# Altium project HFA.PrjPcb
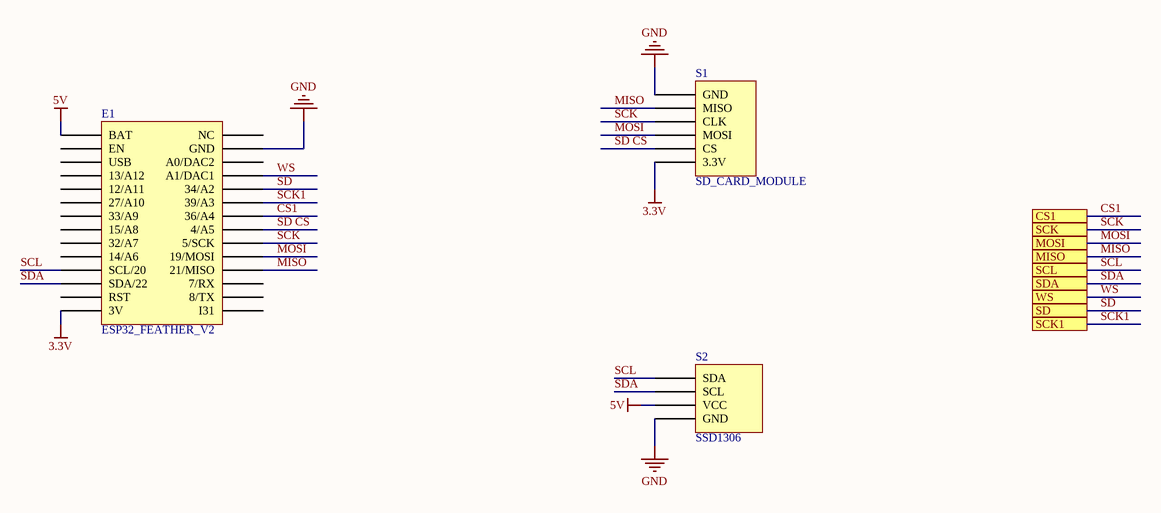
[diagram p0: SCREEN.SchDoc]
3 sheets, 10 parts. Net scope: flat (ports and power ports of the same name join across sheets).
Sheets:
  SCREEN.SchDoc
  SENSOR.SchDoc
  POWER.SchDoc

## Sheet SCREEN.SchDoc
size A4; SheetNumber: 1; SheetTotal: 3

### Parts
E1  ESP32_FEATHER_V2  [ESP32_FEATHER_V2]
S1  SD_CARD_MODULE  [MICRO_SD_CARD_MODULE]
S2  SSD1306  [SSD1306]

### Ports
CS1, MISO, MOSI, SCK, SCK1, SCL, SD, SDA, WS

### Nets
3.3V: E1.15(3V) S1.6(3.3V)
5V: E1.17(BAT) S2.3(VCC)
GND: E1.13(GND) S1.1(GND) S2.4(GND)
CS1: E1.8(36/A4) ; port CS1
MISO: E1.4(21/MISO) S1.2(MISO) ; port MISO
MOSI: E1.5(19/MOSI) S1.4(MOSI) ; port MOSI
SCK: E1.6(5/SCK) S1.3(CLK) ; port SCK
SCK1: E1.9(39/A3) ; port SCK1
SCL: E1.27(SCL/20) S2.1(SDA) ; port SCL
SD: E1.10(34/A2) ; port SD
SD CS: E1.7(4/A5) S1.5(CS)
SDA: E1.28(SDA/22) S2.2(SCL) ; port SDA
WS: E1.11(A1/DAC1) ; port WS

Not connected (* = marked no-connect by the designer): E1 1(I31) 2(8/TX) 3(7/RX) 12(A0/DAC2) 14(NC) 16(RST) 18(EN) 19(USB) 20(13/A12) 21(12/A11) 22(27/A10) 23(33/A9) 24(15/A8) 25(32/A7) 26(14/A6)

### Library data of the parts
E1 = ESP32_FEATHER_V2: ESP32 Feather V2
S2 = SSD1306: 0.96 inch, 128x64

## Sheet SENSOR.SchDoc
size A4; SheetNumber: 2; SheetTotal: 3
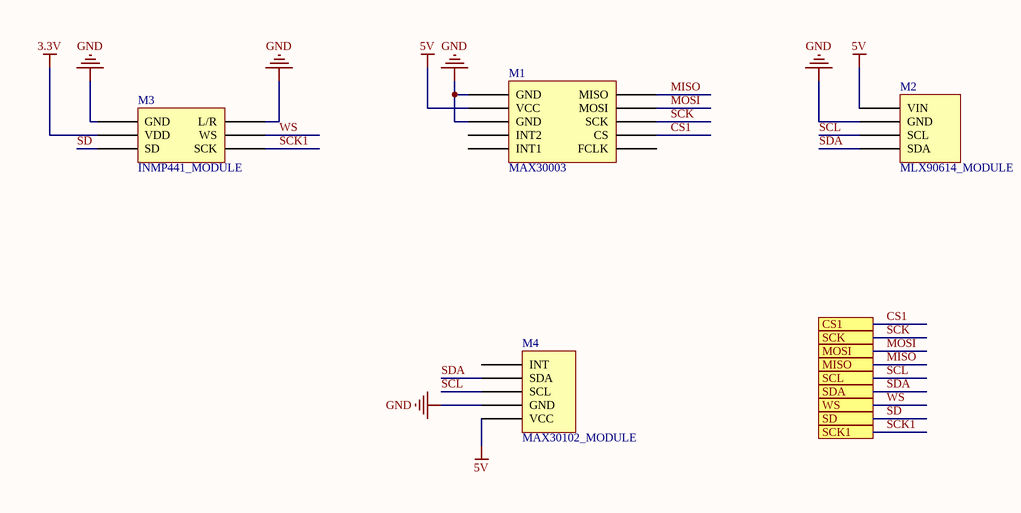
[diagram p1: SENSOR.SchDoc]

### Parts
M1  MAX30003  [MAX30003]
M2  MLX90614_MODULE  [MLX90614_MODULE]
M3  INMP441_MODULE  [INMP441_MODULE]
M4  MAX30102_MODULE  [MAX30102_module]

### Ports
CS1, MISO, MOSI, SCK, SCK1, SCL, SD, SDA, WS

### Nets
3.3V: M3.2(VDD)
5V: M1.VCC M2.1(VIN) M4.5(VCC)
GND: M1.GND M2.2(GND) M3.1(GND) M3.4(L/R) M4.4(GND)
CS1: M1.CS ; port CS1
MISO: M1.MISO ; port MISO
MOSI: M1.MOSI ; port MOSI
SCK: M1.SCK ; port SCK
SCK1: M3.6(SCK) ; port SCK1
SCL: M2.3(SCL) M4.3(SCL) ; port SCL
SD: M3.3(SD) ; port SD
SDA: M2.4(SDA) M4.2(SDA) ; port SDA
WS: M3.5(WS) ; port WS

Not connected (* = marked no-connect by the designer): M1 FCLK INT1 INT2; M4 1(INT)

## Sheet POWER.SchDoc
size A4; SheetNumber: 3; SheetTotal: 3
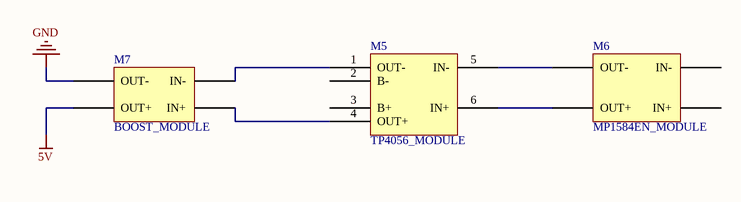
[diagram p2: POWER.SchDoc]

### Parts
M5  TP4056_MODULE  [TP4056_MODULE]
M6  MP1584EN_MODULE  [MP1584EN_MODULE]
M7  BOOST_MODULE  [BOOST_MODULE_MINI]

### Nets
5V: M7.3(OUT+)
GND: M7.4(OUT-)
NetM5_1: M5.1(OUT-) M7.2(IN-)
NetM5_4: M5.4(OUT+) M7.1(IN+)
NetM5_5: M5.5(IN-) M6.4(OUT-)
NetM5_6: M5.6(IN+) M6.3(OUT+)

Not connected (* = marked no-connect by the designer): M5 2(B-) 3(B+); M6 1(IN+) 2(IN-)

## Nets that join several sheets
3.3V: SCREEN (E1.15 S1.6), SENSOR (M3.2)
5V: SCREEN (E1.17 S2.3), SENSOR (M1.VCC M2.1 M4.5), POWER (M7.3)
GND: SCREEN (E1.13 S1.1 S2.4), SENSOR (5 pins), POWER (M7.4)
CS1: SCREEN (E1.8), SENSOR (M1.CS)
MISO: SCREEN (E1.4 S1.2), SENSOR (M1.MISO)
MOSI: SCREEN (E1.5 S1.4), SENSOR (M1.MOSI)
SCK: SCREEN (E1.6 S1.3), SENSOR (M1.SCK)
SCK1: SCREEN (E1.9), SENSOR (M3.6)
SCL: SCREEN (E1.27 S2.1), SENSOR (M2.3 M4.3)
SD: SCREEN (E1.10), SENSOR (M3.3)
SDA: SCREEN (E1.28 S2.2), SENSOR (M2.4 M4.2)
WS: SCREEN (E1.11), SENSOR (M3.5)